# Altium schematic sheet power.SchDoc
size A3
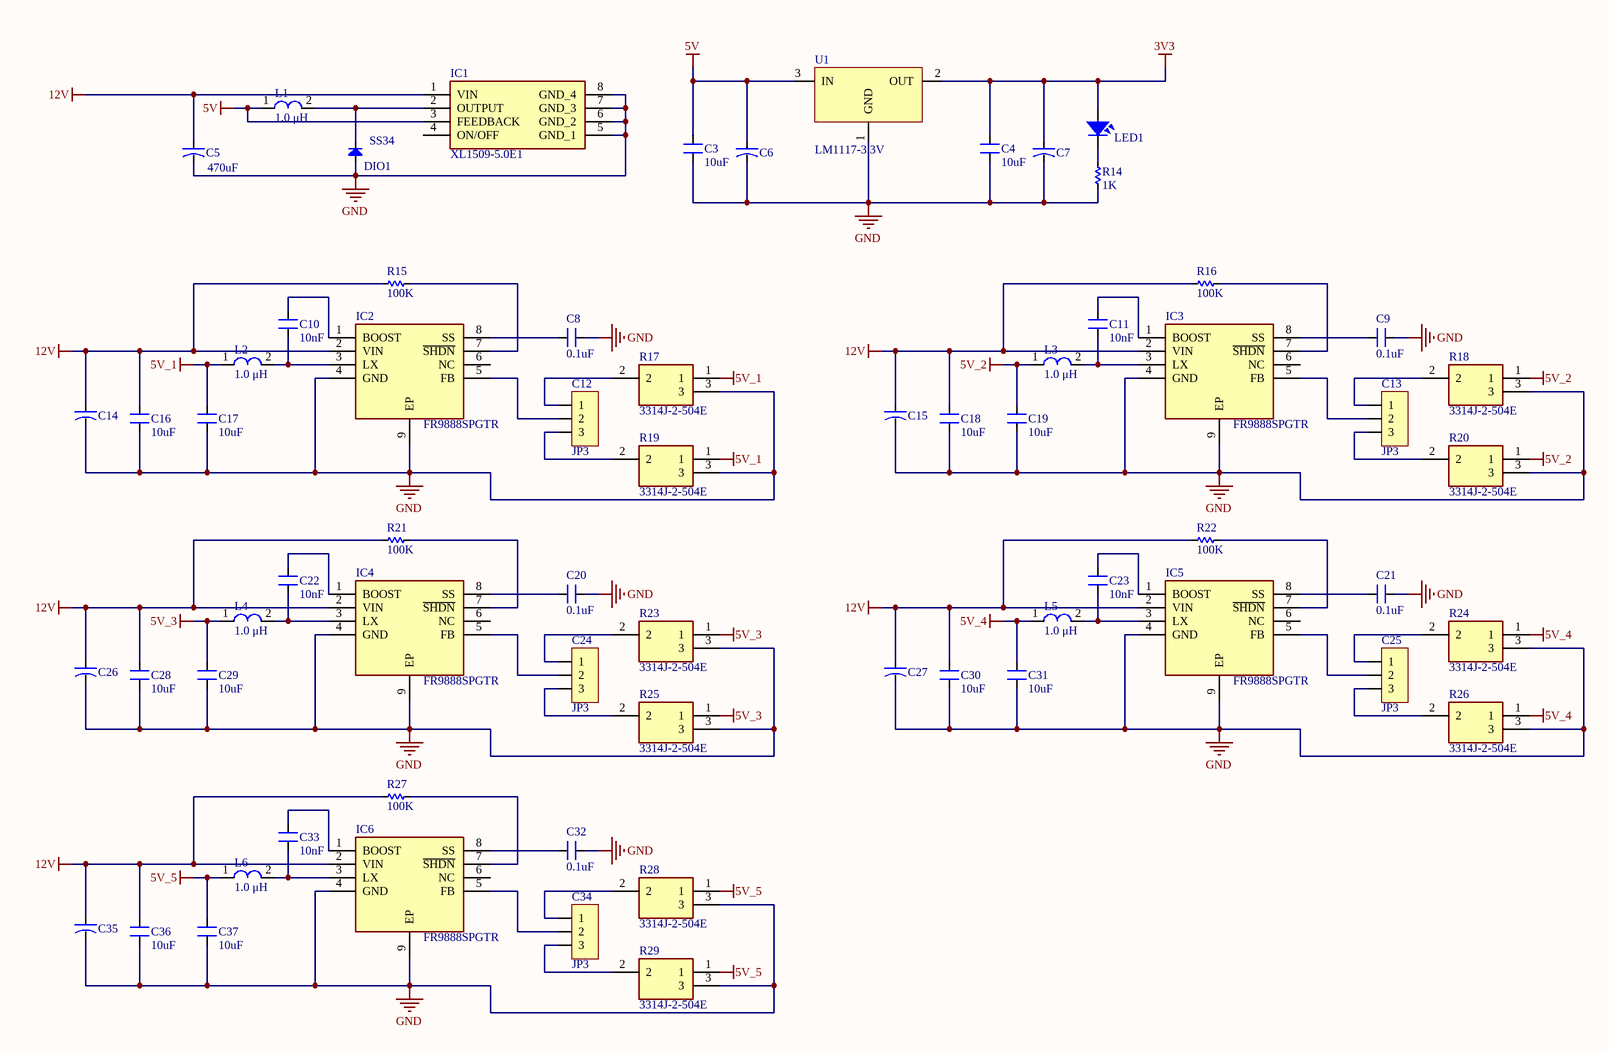
[diagram p0: power.SchDoc]

## Parts
C3  10uF  [CN-SMD-0603]
C4  10uF  [CN-SMD-0603]
C5  470uF  [CAP-ALU-SMD-6.3x7.7x2.2]
C6  CN-ALU-SMD  [CAP-ALU-SMD-4.5x5x1.4]  (value not drawn)
C7  CN-ALU-SMD  [CAP-ALU-SMD-4.5x5x1.4]  (value not drawn)
C8  0.1uF  [CN-SMD-0603]
C9  0.1uF  [CN-SMD-0603]
C10  10nF  [CN-SMD-0603]
C11  10nF  [CN-SMD-0603]
C12  JP3  [JP3-D1T]
C13  JP3  [JP3-D1T]
C14  CN-ALU-SMD  [CAP-ALU-SMD-4.5x5x1.4]  (value not drawn)
C15  CN-ALU-SMD  [CAP-ALU-SMD-4.5x5x1.4]  (value not drawn)
C16  10uF  [CN-SMD-0603]
C17  10uF  [CN-SMD-0603]
C18  10uF  [CN-SMD-0603]
C19  10uF  [CN-SMD-0603]
C20  0.1uF  [CN-SMD-0603]
C21  0.1uF  [CN-SMD-0603]
C22  10nF  [CN-SMD-0603]
C23  10nF  [CN-SMD-0603]
C24  JP3  [JP3-D1T]
C25  JP3  [JP3-D1T]
C26  CN-ALU-SMD  [CAP-ALU-SMD-4.5x5x1.4]  (value not drawn)
C27  CN-ALU-SMD  [CAP-ALU-SMD-4.5x5x1.4]  (value not drawn)
C28  10uF  [CN-SMD-0603]
C29  10uF  [CN-SMD-0603]
C30  10uF  [CN-SMD-0603]
C31  10uF  [CN-SMD-0603]
C32  0.1uF  [CN-SMD-0603]
C33  10nF  [CN-SMD-0603]
C34  JP3  [JP3-D1T]
C35  CN-ALU-SMD  [CAP-ALU-SMD-4.5x5x1.4]  (value not drawn)
C36  10uF  [CN-SMD-0603]
C37  10uF  [CN-SMD-0603]
DIO1  SS34  [DIO-SMD-106]
IC1  XL1509-5.0E1  [SOIC127P600X175-8N]
IC2  FR9888SPGTR  [SOIC127P600X170-9N]
IC3  FR9888SPGTR  [SOIC127P600X170-9N]
IC4  FR9888SPGTR  [SOIC127P600X170-9N]
IC5  FR9888SPGTR  [SOIC127P600X170-9N]
IC6  FR9888SPGTR  [SOIC127P600X170-9N]
L1  1.0 μH  [L-SMD-M-7.3x4.5]
L2  1.0 μH  [L-SMD-M-7.3x4.5]
L3  1.0 μH  [L-SMD-M-7.3x4.5]
L4  1.0 μH  [L-SMD-M-7.3x4.5]
L5  1.0 μH  [L-SMD-M-7.3x4.5]
L6  1.0 μH  [L-SMD-M-7.3x4.5]
LED1  LED  [LED-0805-Blue]  (value not drawn)
R14  1K  [RES-SMD-0603]
R15  100K  [RES-SMD-0603]
R16  100K  [RES-SMD-0603]
R17  3314J-2-504E  [3314J-1]
R18  3314J-2-504E  [3314J-1]
R19  3314J-2-504E  [3314J-1]
R20  3314J-2-504E  [3314J-1]
R21  100K  [RES-SMD-0603]
R22  100K  [RES-SMD-0603]
R23  3314J-2-504E  [3314J-1]
R24  3314J-2-504E  [3314J-1]
R25  3314J-2-504E  [3314J-1]
R26  3314J-2-504E  [3314J-1]
R27  100K  [RES-SMD-0603]
R28  3314J-2-504E  [3314J-1]
R29  3314J-2-504E  [3314J-1]
U1  LM1117-3.3V  [SOT223]

## Nets
3V3: C4.1 C7.1 LED1.1 U1.2(OUT)
5V: C3.1 C6.1 IC1.3(FEEDBACK) L1.1 U1.3(IN)
5V_1: C17.1 L2.1 R17.1 R19.1
5V_2: C19.1 L3.1 R18.1 R20.1
5V_3: C29.1 L4.1 R23.1 R25.1
5V_4: C31.1 L5.1 R24.1 R26.1
5V_5: C37.1 L6.1 R28.1 R29.1
12V: C5.1 C14.1 C15.1 C16.1 C18.1 C26.1 C27.1 C28.1 C30.1 C35.1 C36.1 IC1.1(VIN) IC2.2(VIN) IC3.2(VIN) IC4.2(VIN) IC5.2(VIN) IC6.2(VIN) R15.1 R16.1 R21.1 R22.1 R27.1
GND: C3.2 C4.2 C5.2 C6.2 C7.2 C8.1 C9.1 C14.2 C15.2 C16.2 C17.2 C18.2 C19.2 C20.1 C21.1 C26.2 C27.2 C28.2 C29.2 C30.2 C31.2 C32.1 C35.2 C36.2 C37.2 DIO1.1(A) IC1.5(GND_1) IC1.6(GND_2) IC1.7(GND_3) IC1.8(GND_4) IC2.4(GND) IC2.9(EP) IC3.4(GND) IC3.9(EP) IC4.4(GND) IC4.9(EP) IC5.4(GND) IC5.9(EP) IC6.4(GND) IC6.9(EP) R14.2 R17.3 R18.3 R19.3 R20.3 R23.3 R24.3 R25.3 R26.3 R28.3 R29.3 U1.1(GND)
NetC8_2: C8.2 IC2.8(SS)
NetC9_2: C9.2 IC3.8(SS)
NetC10_1: C10.1 IC2.3(LX) L2.2
NetC10_2: C10.2 IC2.1(BOOST)
NetC11_1: C11.1 IC3.3(LX) L3.2
NetC11_2: C11.2 IC3.1(BOOST)
NetC12_1: C12.1 R17.2
NetC12_2: C12.2 IC2.5(FB)
NetC12_3: C12.3 R19.2
NetC13_1: C13.1 R18.2
NetC13_2: C13.2 IC3.5(FB)
NetC13_3: C13.3 R20.2
NetC20_2: C20.2 IC4.8(SS)
NetC21_2: C21.2 IC5.8(SS)
NetC22_1: C22.1 IC4.3(LX) L4.2
NetC22_2: C22.2 IC4.1(BOOST)
NetC23_1: C23.1 IC5.3(LX) L5.2
NetC23_2: C23.2 IC5.1(BOOST)
NetC24_1: C24.1 R23.2
NetC24_2: C24.2 IC4.5(FB)
NetC24_3: C24.3 R25.2
NetC25_1: C25.1 R24.2
NetC25_2: C25.2 IC5.5(FB)
NetC25_3: C25.3 R26.2
NetC32_2: C32.2 IC6.8(SS)
NetC33_1: C33.1 IC6.3(LX) L6.2
NetC33_2: C33.2 IC6.1(BOOST)
NetC34_1: C34.1 R28.2
NetC34_2: C34.2 IC6.5(FB)
NetC34_3: C34.3 R29.2
NetDIO1_2: DIO1.2(K) IC1.2(OUTPUT) L1.2
NetIC2_7: IC2.7(~{SHDN}) R15.2
NetIC3_7: IC3.7(~{SHDN}) R16.2
NetIC4_7: IC4.7(~{SHDN}) R21.2
NetIC5_7: IC5.7(~{SHDN}) R22.2
NetIC6_7: IC6.7(~{SHDN}) R27.2
NetLED1_2: LED1.2 R14.1

Not connected (* = marked no-connect by the designer): IC1 4(ON/OFF); IC2 6(NC); IC3 6(NC); IC4 6(NC); IC5 6(NC); IC6 6(NC)

## Library data of the parts
C3 C4 C8-C11 C16-C23 C28-C33 C36 C37 = CN: Tu gom; Value: 33pF
C5-C7 C14 C15 C26 C27 C35 = CN-ALU-SMD: Polarized Capacitor (Axial); Published: 8-Jun-2000; LatestRevisionDate: 17-Jul-2002; LatestRevisionNote: Re-released for DXP Platform.; PackageReference: POLAR0.8; Publisher: Altium Limited
C12 C13 C24 C25 C34 = JP3: WR-PHD 2.54 mm Angled Socket Header; Manufacturer: W¨¹rth Elektronik eiSos GmbH; partNo: 613003143121; ComponentLink1 Description: Manufacturer; ComponentLink2 Description: Datasheet; NoPins: 03; Created Date: 29 March 2013; ComponentLink1URL: http://www.we-online.com; ComponentLink2URL: http://katalog.we-online.de/em/datasheet/6130xx143121.pdf; Created by: Karrer Zheng
DIO1 = Diode SMD: Default Diode; Code - JEDEC: DO-214-AB; Value: 1N5007; Published: 8-Jun-2000; Revision: July-2002: Re-released for DXP Platform.; Publisher: Altium Limited
IC1 = XL1509-5.0E1: Integrated Circuit; Manufacturer_Name: XLSEMI; Datasheet Link: https://datasheet.lcsc.com/szlcsc/XLSEMI-XL1509-5-0E1_C61063.pdf; Height: 1.75mm; Manufacturer_Part_Number: XL1509-5.0E1
IC2-IC6 = FR9888SPGTR: Integrated Circuit; Manufacturer_Name: Fitipower; Datasheet Link: https://datasheet.lcsc.com/szlcsc/Fitipower-Integrated-Tech-FR9888SPGTR_C80507.pdf; Height: 1.7mm; Manufacturer_Part_Number: FR9888SPGTR
L1-L6 = L-SMD-1: partNo: 78477010; Manufacturer: Wurth Elektronik; Inductance: 1.0 μH; ComponentLink1Description: Manufacturer; ComponentLink1URL: http://www.we-online.de; Created by: Baojun Chen; Created Date: Nov.2015; ComponentLink2Description: Datasheet; ComponentLink2URL: http://katalog.we-online.de/pbs/datasheet/78477010.pdf
LED1 = LED SMD: Value: LED 3 - 5 ly 2 Colour
R14-R16 R21 R22 R27 = Res-SMD: Resistor; Manufacturer: Generic Components; Class: Passive; Published: 08/06/2000; Publisher: Altium Hobart Technology Centre
R17-R20 R23-R26 R28 R29 = 3314J-2-504E: Resistor; Manufacturer_Name: Bourns; Datasheet Link: http://www.bourns.com/docs/Product-Datasheets/3314.pdf; Manufacturer_Part_Number: 3314J-2-504E; Mouser Part Number: 652-3314J-2-504E; Mouser Price/Stock: https://www.mouser.co.uk/ProductDetail/Bourns/3314J-2-504E?qs=QXsCy0sQn1B1cVm1aQFSNQ%3D%3D; Arrow Part Number: 3314J-2-504E; Arrow Price/Stock: https://www.arrow.com/en/products/3314j-2-504e/bourns
U1 = LM1117: 800mA Low-Dropout Linear Regulator; Creator: Nguyen Ba Bien; Website: http://group3i.net